# Altium schematic sheet Sata.SchDoc
size A3; PageSetup: Record=PageOptions|CenterHorizontal=True|CenterVertical=True|PrintScale=0.73|XCorrection=1.00|YCorrection=1.00|PrintKind=0|BorderSize=5000000|LeftOffset=0|BottomOffset=0|Orientation=2|PaperLength=1000|PaperWidth=1000|Scale=100|PaperSource=7|PrintQuality=-4|MediaType=1|DitherType=10|PaperKind=A4|PrintScaleMode=1; Date: 27.05.2014; DrawnBy: luths8; Organization: BFH; Address1: Bern University of Applied Sciences; Address2: Engineering and Information Technology; Address3: Jlcoweg 1; Address4: CH-3400 Burgdorf; DocumentNumber: 13; Revision: 1.0; SheetNumber: 16; SheetTotal: 19; CurrentDate: 27.05.2014
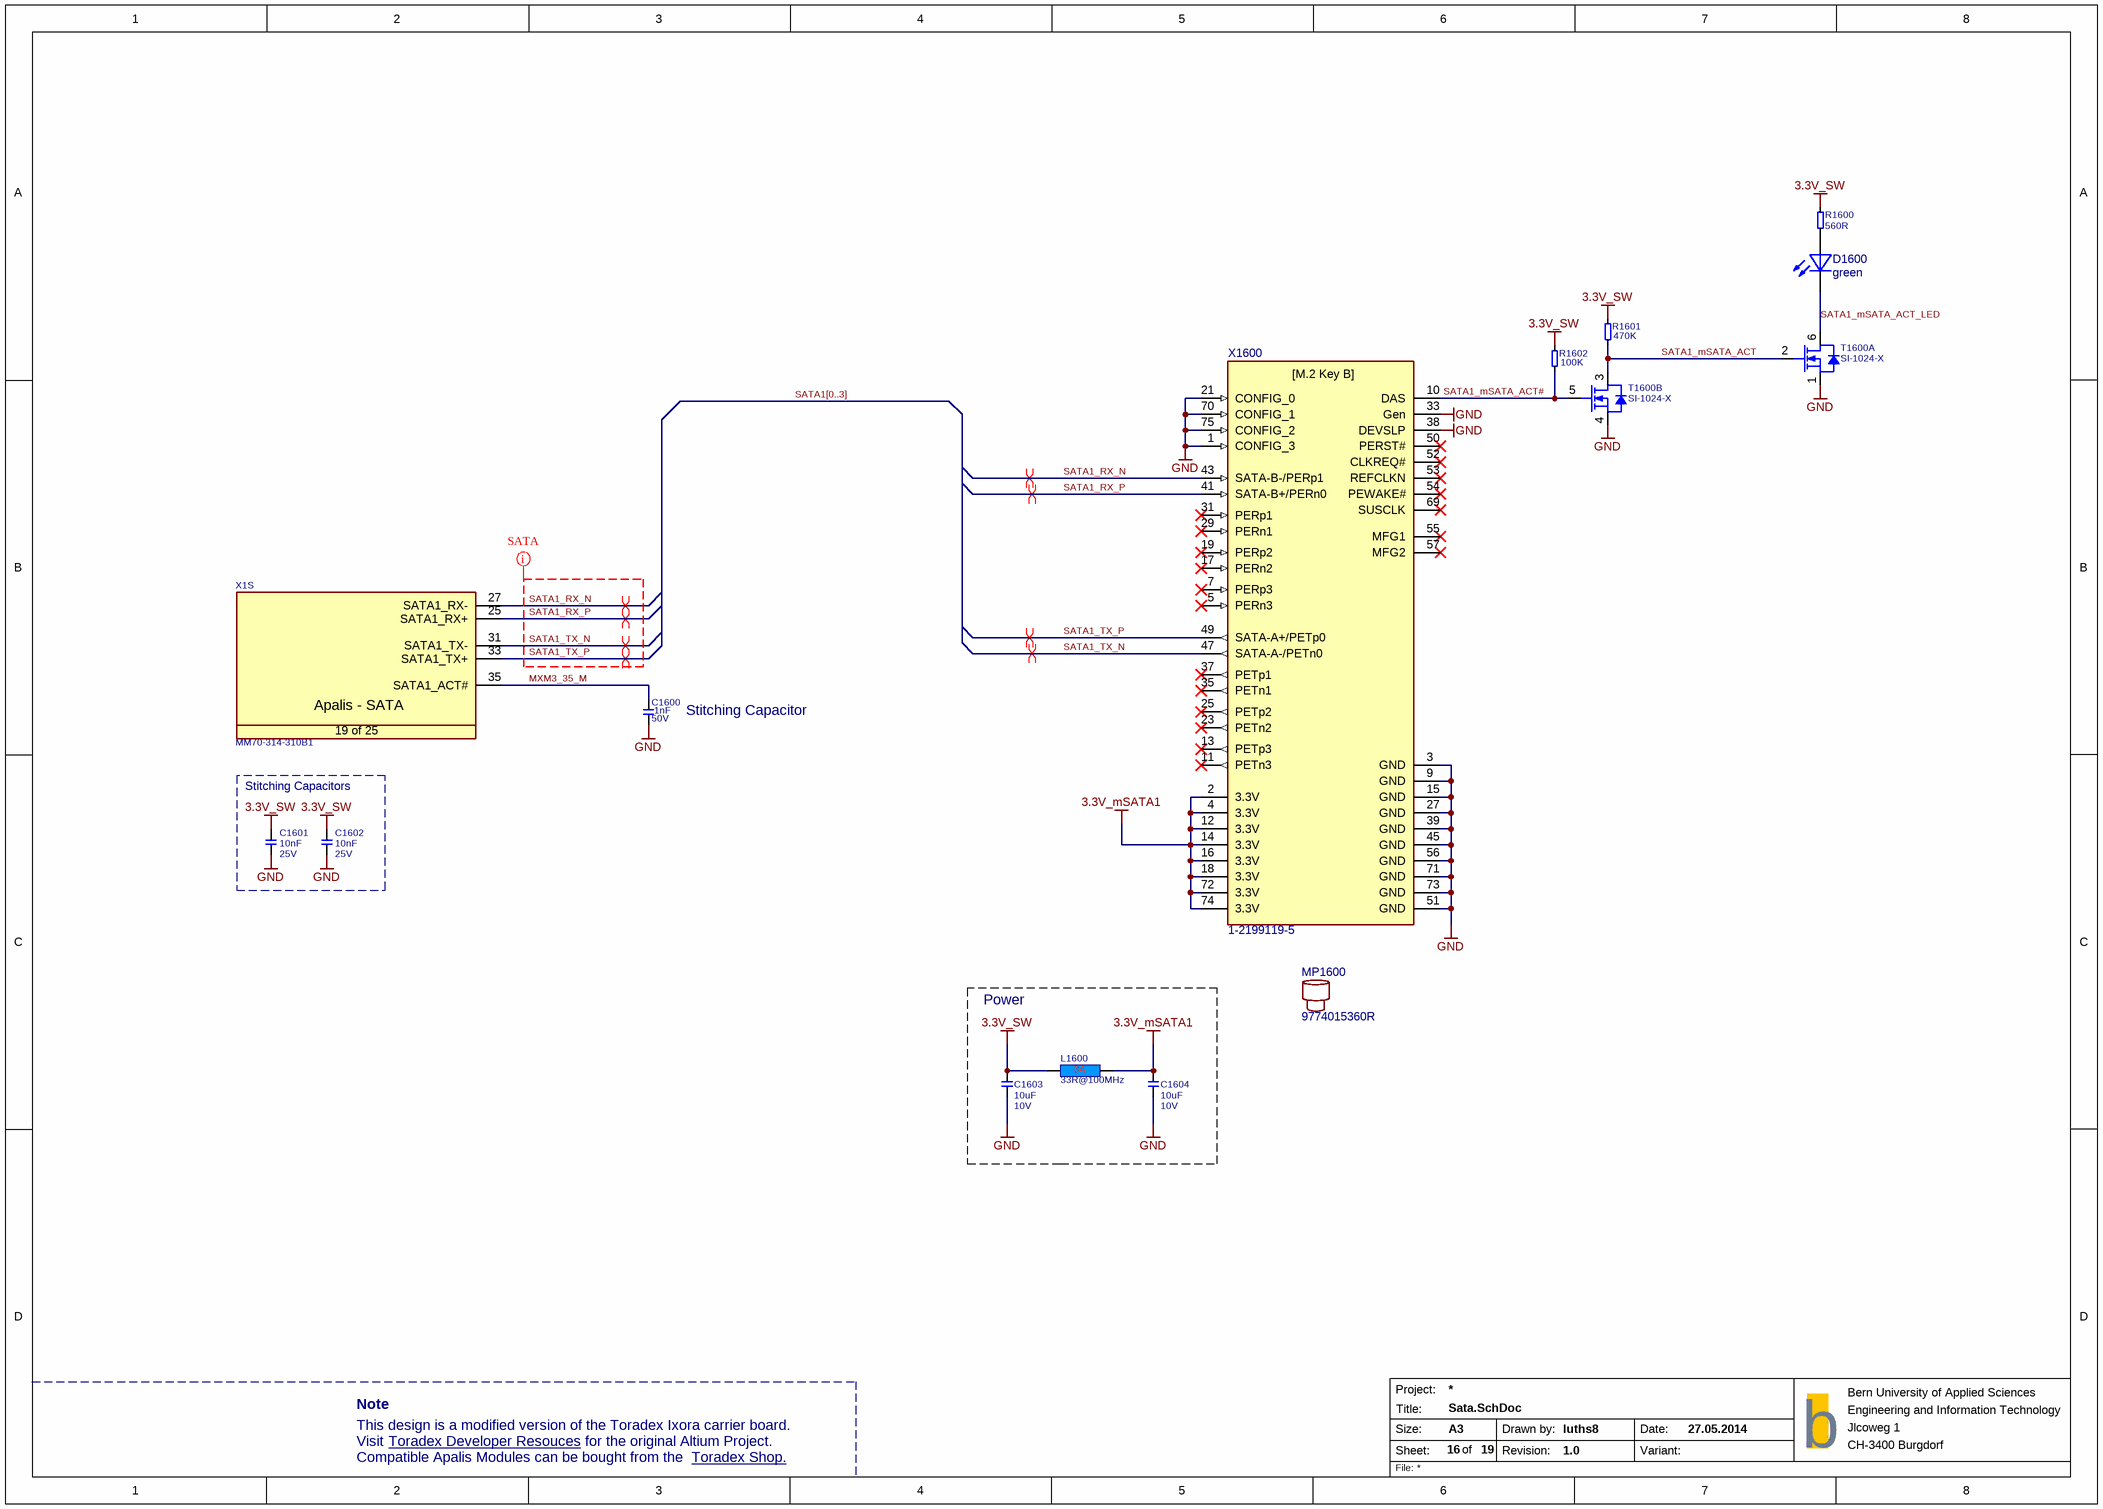
[diagram p0: Sata.SchDoc]

## Parts
C1600  Rating: 50V  [SMD0603CAP]  (hidden comment: 1nF)
C1601  10nF  Rating: 25V  [SMD0603CAP]
C1602  10nF  Rating: 25V  [SMD0603CAP]
C1603  Rating: 10V  [SMD0603CAP]  (hidden comment: 10uF)
C1604  Rating: 10V  [SMD0603CAP]  (hidden comment: 10uF)
D1600  green  [LED]
L1600  33R@100MHz  [INDC1608X95N]
MP1600  9774015360R
R1600  560R  [SMD0603RES]
R1601  470K  [SMD0603RES]
R1602  100K  [SMD0603RES]
T1600  Manufacturer Part No.: SI-1024-X  [SOTFL50P160X60-6N]  (hidden comment: T-Vishay-SI-1024X-N)  (parts A,B of 2)
X1  Manufacturer Part No.: MM70-314-310B1  [T_JAE_MM70-314-310B1]  (hidden comment: CON-JAE-MM70-314-310B1-314-0.5mm)  (part S of 25)
X1600  1-2199119-5  [1-2199119-5-Key-M-2280]

## Blocks framed on the sheet
Stitching Capacitors: C1601 C1602
Power: C1603 C1604 L1600

## Nets
3.3V_mSATA1: C1604.2 L1600.2 X1600.2(3.3V) X1600.4(3.3V) X1600.12(3.3V) X1600.14(3.3V) X1600.16(3.3V) X1600.18(3.3V) X1600.72(3.3V) X1600.74(3.3V)
3.3V_SW: C1601.2 C1602.2 C1603.2 L1600.1 R1600.1 R1601.1 R1602.2
GND: C1600.1 C1601.1 C1602.1 C1603.1 C1604.1 T1600.1(S) T1600.4(S) X1600.1(CONFIG_3) X1600.3(GND) X1600.9(GND) X1600.15(GND) X1600.21(CONFIG_0) X1600.27(GND) X1600.33(Gen) X1600.38(DEVSLP) X1600.39(GND) X1600.45(GND) X1600.51(GND) X1600.56(GND) X1600.70(CONFIG_1) X1600.71(GND) X1600.73(GND) X1600.75(CONFIG_2)
MXM3_35_M: C1600.2 X1.35(SATA1_ACT#)
SATA1_mSATA_ACT: R1601.2 T1600.2(G) T1600.3(D)
SATA1_mSATA_ACT#: R1602.1 T1600.5(G) X1600.10(DAS)
SATA1_mSATA_ACT_LED: D1600.C T1600.6(D)
SATA1_RX_N: X1.27(SATA1_RX-) X1600.43(SATA-B-/PERp1)
SATA1_RX_P: X1.25(SATA1_RX+) X1600.41(SATA-B+/PERn0)
SATA1_TX_N: X1.31(SATA1_TX-) X1600.47(SATA-A-/PETn0)
SATA1_TX_P: X1.33(SATA1_TX+) X1600.49(SATA-A+/PETp0)
NetD1600_A: D1600.A R1600.2

Not connected (* = marked no-connect by the designer): X1600 5(PERn3)* 7(PERp3)* 11(PETn3)* 13(PETp3)* 17(PERn2)* 19(PERp2)* 23(PETn2)* 25(PETp2)* 29(PERn1)* 31(PERp1)* 35(PETn1)* 37(PETp1)* 50(PERST#)* 52(CLKREQ#)* 53(REFCLKN)* 54(PEWAKE#)* 55(MFG1)* 57(MFG2)* 69(SUSCLK)*

## Buses and harness runs
bus SATA1[0..3]

## Layout directives
differential pair: SATA1_RX_N, SATA1_RX_P, SATA1_TX_N, SATA1_TX_P
net class SATA: SATA1_RX_N, SATA1_RX_P, SATA1_TX_N, SATA1_TX_P

## Notes on the sheet
- (near C1600) Stitching Capacitor
- Note
- This design is a modified version of the Toradex Ixora carrier board.
- Visit
- Compatible Apalis Modules can be bought from the
- Toradex Developer Resouces <https://developer.toradex.com/products/ixora-carrier-board>
- for the original Altium Project.
- Toradex Shop. <https://www.toradex.com/order-now/apalis-arm-family>
- Project:
- Size:
- Sheet:
- Title:
- A3
- of
- Drawn by:
- Revision:
- Date:
- Variant:
- b
- File:
- (in symbol CON-JAE-MM70-314-310B1-314-0.5mm, part S) Apalis - SATA; 19 of 25
- (in symbol Connector M.2 Key M) [M.2 Key B]

## Library data of the parts
C1600 = C-X7R-1nF-50V-10%-0402: Capacitor Ceramic X7R 1nF 50V 10% 0603; Tolerance: 10%; Type: X7R; Value: 1nF
C1601 C1602 = C-X7R-10nF-25V-10%-0603: Capacitor Ceramic X7R 10nF 25V 10% 0603; Tolerance: 10%; Type: X7R; Value: 10nF
C1603 C1604 = C-X5R-10uF-10V-20%-0603: Capacitor Ceramic X5R 10uF 10V 20% 0603; Tolerance: 20%; Type: X5R; Value: 10uF
D1600 = LED green: Manufacturer Part No.: LGM67KG1J224Z
L1600 = L-33R@100MHz-3A-25%-0603: 33R@100MHz 3A EMI FILTER; Tolerance: 25%; Rating: 3A; Value: 33R@100MHz
MP1600 = Spacer M3 SMD: Manufacturer Part No.: 9774015360R
R1600 = R-560R-63mW-5%-0402: Resistor 560 ohm 63mW 5% 0603; Rating: 63mW; Tolerance: 5%; Value: 560R
R1601 = R-470KR-63mW-5%-0402: Resistor 470 Kohm 63mW 5% 0603; Value: 470KR; Rating: 63mW; Tolerance: 5%
R1602 = R-100KR-63mW-5%-0402: Resistor 100 Kohm 63mW 5% 0603; Value: 100KR; Rating: 63mW; Tolerance: 5%
T1600 = T-Vishay-SI-1024X-N: Dual N-Channel 20V (D-S)  MOSFET; Manufacturer Name: Vishay
X1 = CON-JAE-MM70-314-310B1-314-0.5mm: MXM3 Connector; Manufacturer Name: JAE; No. of ways: 314
X1600 = Connector M.2 Key M: Manufacturer Part No.: 1-2199119-5